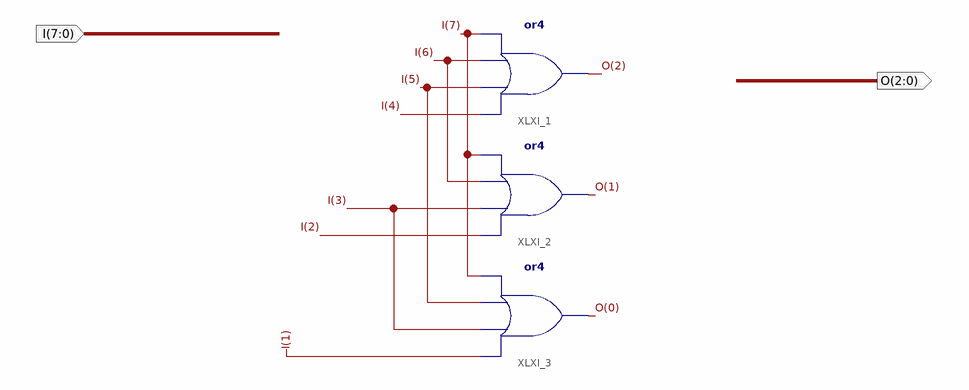
[diagram p0: schematic sheet 1]
// Xilinx ISE schematic E8_3encoder.sch (spartan6) as structural Verilog: 3 symbols, 2 ports
module E8_3encoder (
  input  [7:0] I,
  output [2:0] O
);

  or XLXI_1 (O[2], I[4], I[5], I[6], I[7]);
  or XLXI_2 (O[1], I[2], I[3], I[6], I[7]);
  or XLXI_3 (O[0], I[1], I[3], I[5], I[7]);
endmodule
